# Altium project Template.PrjPCB
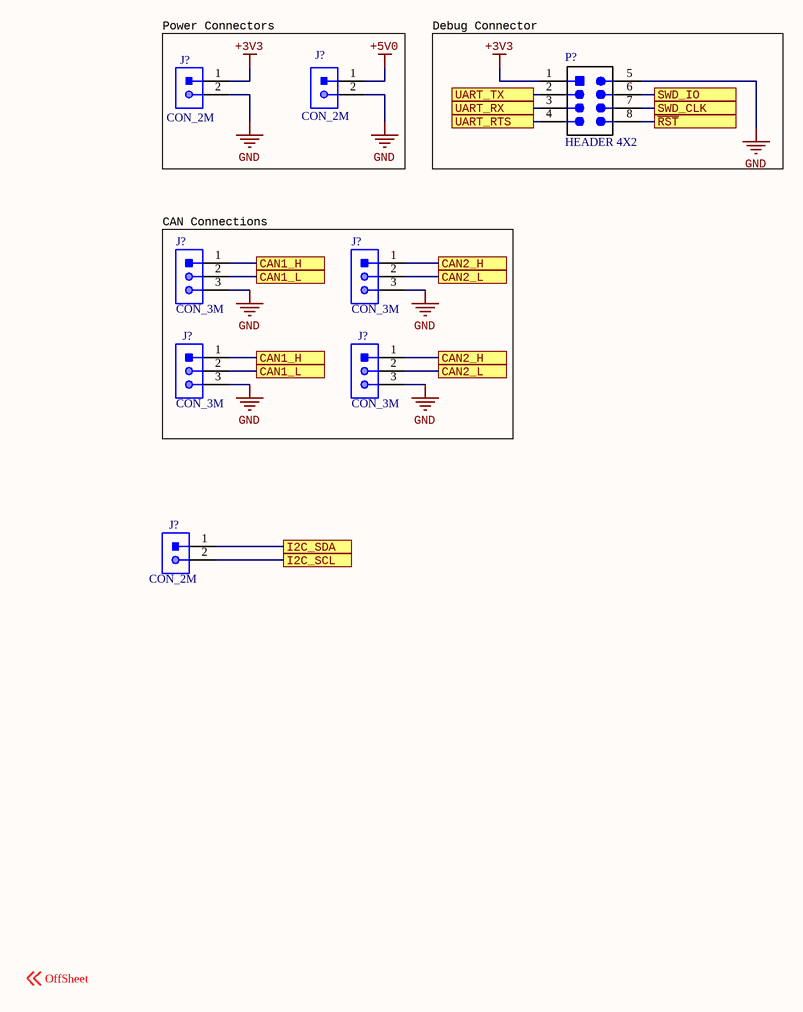
[diagram p0: Connectors.SchDoc]
DrawnBy: Your Name; BoardName: Your Board Name; Address4: Canada N2L 3G6; Address3: Ontario; Address2: Waterloo; Address1: 200 University Avenue
5 sheets, 45 parts. Net scope: flat (ports and power ports of the same name join across sheets).
Board file: Template.PcbDoc
Sheets:
  Connectors.SchDoc
  Support.SchDoc
  CAN.SchDoc
  MCU.SchDoc
  Power.SchDoc

## Sheet Connectors.SchDoc
size A4

### Parts
(Parts that share a designator on the sheet are numbered #1, #2 ... from top to bottom, then left to right.)
J?#1  CON_2M  [JST-B2B-PHSK]
J?#2  CON_2M  [JST-B2B-PHSK]
J?#3  CON_3M  [JST-B3B-SM4-TB]
J?#4  CON_3M  [JST-B3B-SM4-TB]
J?#5  CON_3M  [JST-B3B-SM4-TB]
J?#6  CON_3M  [JST-B3B-SM4-TB]
J?#7  CON_2M  [JST-B2B-PHSK]
P?  HEADER 4X2  [HEADER_2X4]

### Blocks framed on the sheet
Power Connectors: J?#1 J?#2
Debug Connector: P?
CAN Connections: J?#3-J?#6

### Ports
CAN1_H, CAN1_L, CAN2_H, CAN2_L, I2C_SCL, I2C_SDA, SWD_CLK, SWD_IO, UART_RTS, UART_RX, UART_TX, ~{RST}

### Nets
+3V3: J?#1.1 P?.1(VCC)
+5V0: J?#2.1
GND: J?#1.2 J?#2.2 J?#3.3 J?#4.3 J?#5.3 J?#6.3 P?.5(GND)  [project net  GND]
NetC4_2: P?.8 ; port ~{RST}
NetJ?#3_1: J?#3.1 J?#5.1 ; port CAN1_H
NetJ?#3_2: J?#3.2 J?#5.2 ; port CAN1_L
NetJ?#4_1: J?#4.1 J?#6.1 ; port CAN2_H
NetJ?#4_2: J?#4.2 J?#6.2 ; port CAN2_L
NetJ?#7_1: J?#7.1 ; port I2C_SDA
NetJ?#7_2: J?#7.2 ; port I2C_SCL
NetP?_2: P?.2 ; port UART_TX
NetP?_3: P?.3 ; port UART_RX
NetP?_4: P?.4 ; port UART_RTS
NetP?_6: P?.6 ; port SWD_IO
NetP?_7: P?.7 ; port SWD_CLK

### Notes on the sheet
- Labels drawn without touching a wire or pin: OffSheet

### Library data of the parts
P? = HEADER 4X2: Header, 4-Pin Dual row; MPN: GRPB042VWVN-RC; Manufacturer: Sullins Connector Solutions; Digikey Part Number: S9015E-04-ND

## Sheet Support.SchDoc
size A4
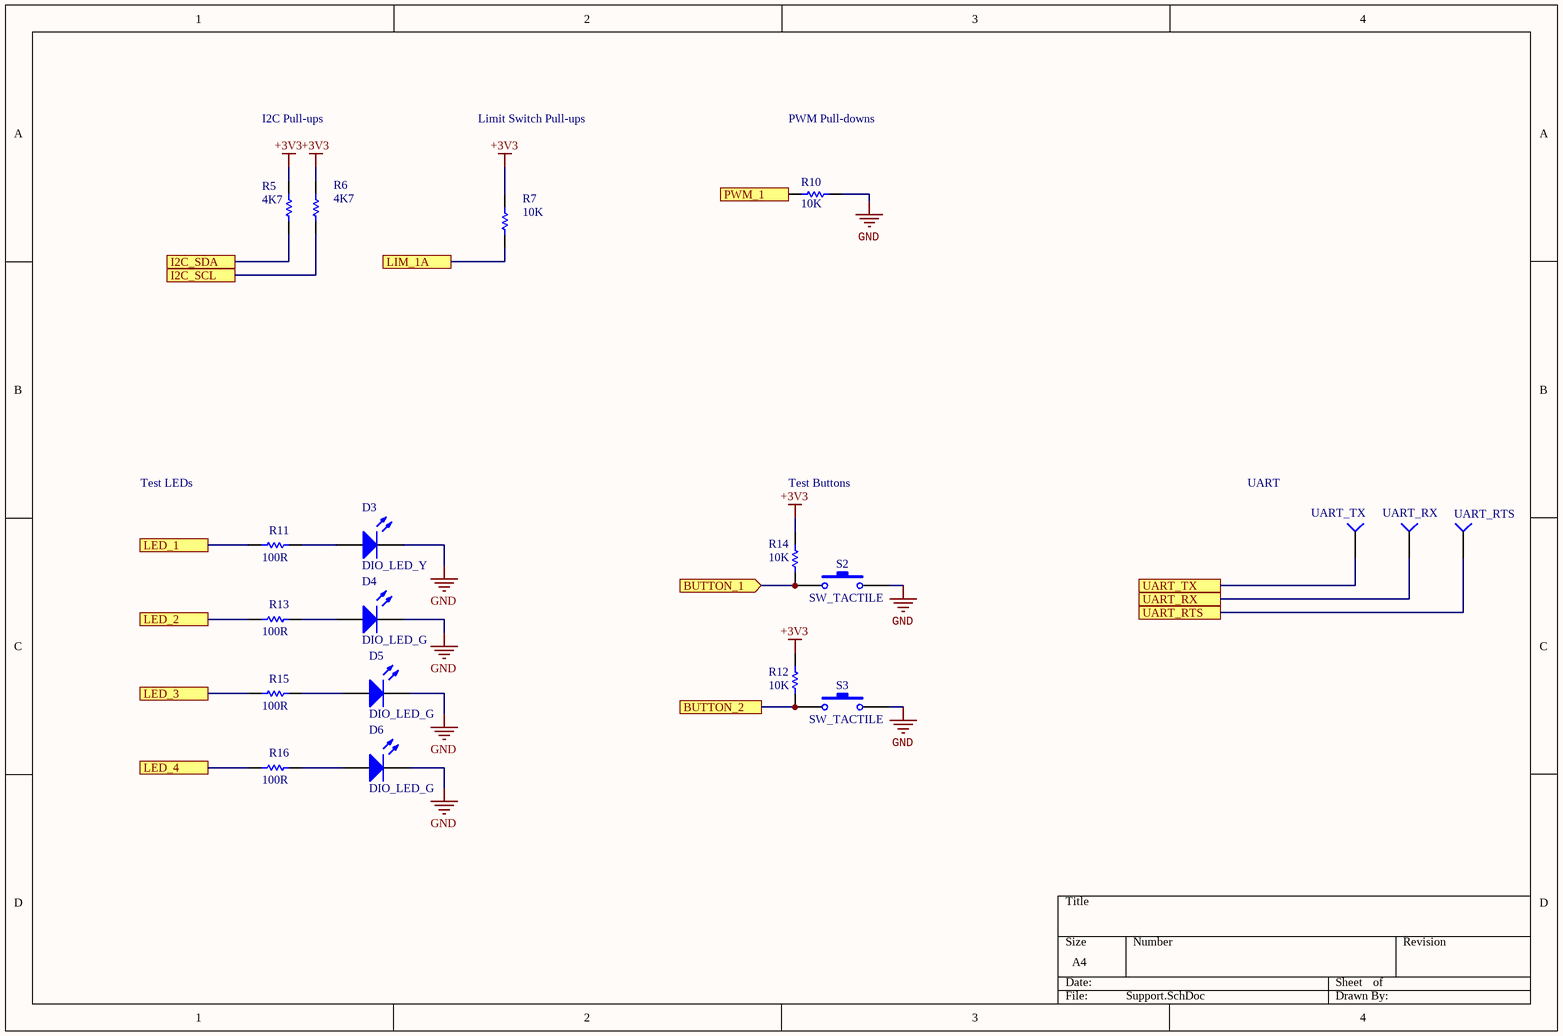
[diagram p1: Support.SchDoc]

### Parts
D3  DIO_LED_Y  [LED_0805_LINE]
D4  DIO_LED_G  [LED_0805_LINE]
D5  DIO_LED_G  [LED_0805_LINE]
D6  DIO_LED_G  [LED_0805_LINE]
R5  value 4K7  [RESC0603(1608)_N]  (hidden comment: RES_4K7_0603)
R6  value 4K7  [RESC0603(1608)_N]  (hidden comment: RES_4K7_0603)
R7  value 10K  [RESC0603(1608)_N]  (hidden comment: RES_10K_0603)
R10  value 10K  [RESC0603(1608)_N]  (hidden comment: RES_10K_0603)
R11  value 100R  [RESC0603(1608)_N]  (hidden comment: RES_100R_0603)
R12  value 10K  [RESC0603(1608)_N]  (hidden comment: RES_10K_0603)
R13  value 100R  [RESC0603(1608)_N]  (hidden comment: RES_100R_0603)
R14  value 10K  [RESC0603(1608)_N]  (hidden comment: RES_10K_0603)
R15  value 100R  [RESC0603(1608)_N]  (hidden comment: RES_100R_0603)
R16  value 100R  [RESC0603(1608)_N]  (hidden comment: RES_100R_0603)
S2  SW_TACTILE  [B3U-1100P]
S3  SW_TACTILE  [B3U-1100P]
UART_RTS  TESTPOINT  (value not drawn)
UART_RX  TESTPOINT  (value not drawn)
UART_TX  TESTPOINT  (value not drawn)

### Ports
BUTTON_1 (in), BUTTON_2, I2C_SCL, I2C_SDA, LED_1, LED_2, LED_3, LED_4, LIM_1A, PWM_1, UART_RTS, UART_RX, UART_TX

### Nets
+3V3: R5.2 R6.2 R7.2 R12.2 R14.1
GND: D3.2(K) D4.2(K) D5.2(K) D6.2(K) R10.1 S2.2 S3.2  [project net  GND]
NetD3_1: D3.1(A) R11.2
NetD4_1: D4.1(A) R13.2
NetD5_1: D5.1(A) R15.2
NetD6_1: D6.1(A) R16.2
NetJ?#7_1: R5.1 ; port I2C_SDA
NetJ?#7_2: R6.1 ; port I2C_SCL
NetP?_2: UART_TX.1(=value) ; port UART_TX
NetP?_3: UART_RX.1(=value) ; port UART_RX
NetP?_4: UART_RTS.1(=value) ; port UART_RTS
NetR7_1: R7.1 ; port LIM_1A
NetR10_2: R10.2 ; port PWM_1
NetR11_1: R11.1 ; port LED_1
NetR12_1: R12.1 S3.1 ; port BUTTON_2
NetR13_1: R13.1 ; port LED_2
NetR14_2: R14.2 S2.1 ; port BUTTON_1
NetR15_1: R15.1 ; port LED_3
NetR16_1: R16.1 ; port LED_4

### Notes on the sheet
- I2C Pull-ups
- Limit Switch Pull-ups
- PWM Pull-downs
- Test LEDs
- Test Buttons
- UART

### Library data of the parts
D3 = DIO_LED_Y: LED YELLOW DIFFUSED 0805 SMD; Manufacturer: OSRAM; MPN: LY R976-PS-36; Forward Voltage Drop: 2.2V; Package: 0805 (2012 Metric); Digikey Part Number: 475-2560-1-ND
D4-D6 = DIO_LED_G: LED GREEN DIFFUSED 0805 SMD; Manufacturer: OSRAM; MPN: LG R971-KN-1; Forward Voltage Drop: 2.2V; Package: 0805 (2012 Metric); Digikey Part Number: 475-1410-1-ND
R5 R6 = RES_4K7_0603: RES SMD 4.7K OHM 5% 1/10W 0603; Manufacturer: Yageo; MPN: RC0603JR-074K7L; Package: 0603 (1608 Metric); Dimensions: 0.063" L x 0.031" W (1.60mm x 0.80mm); Tolerance: 5%; Digikey Part Number: 311-4.7KGRCT-ND
R7 R10 R12 R14 = RES_10K_0603: RES SMD 10K OHM 5% 1/10W 0603; Manufacturer: Yageo; MPN: RC0603JR-0710KL; Package: 0603 (1608 Metric); Dimensions: 0.063" L x 0.031" W (1.60mm x 0.80mm); Tolerance: 5%; Digikey Part Number: 311-10KGRCT-ND
R11 R13 R15 R16 = RES_100R_0603: RES SMD 100 OHM 1% 1/10W 0603; Manufacturer: Yageo; MPN: RC0603FR-07100RL; Package: 0603 (1608 Metric); Dimensions: 0.063" L x 0.031" W (1.60mm x 0.80mm); Tolerance: 1%; Digikey Part Number: 311-100HRCT-ND
S2 S3 = SW_TACTILE: Tactile Switch (Grey); Manufacturer: Omron Electronics Inc-EMC Div; Digikey Part Number: SW1021TR-ND; MPN: B3U-1100P

## Sheet CAN.SchDoc
size A4
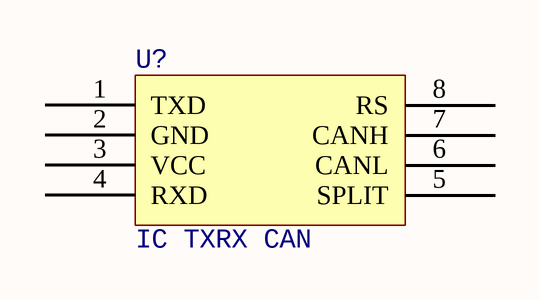
[diagram p2: CAN.SchDoc]

### Parts
U?  IC TXRX CAN  [LT-S8_N]

### Nets

Not connected (* = marked no-connect by the designer): U? 1(TXD) 2(GND) 3(VCC) 4(RXD) 5(SPLIT) 6(CANL) 7(CANH) 8(RS)

### Library data of the parts
U? = LTC2875: IC TXRX CAN 4MBPS 8SO; Manufacturer: Linear Technologies; MPN: LTC2875IS8#PBF; Package: 8-SOIC (0.154", 3.90mm Width); ComponentLink1Description: Datasheet; ComponentLink1URL: https://www.analog.com/media/en/technical-documentation/data-sheets/2875f.pdf; Digikey Part Number: LTC2875IS8#PBF-ND

## Sheet MCU.SchDoc
size Letter; Organization: UW Robotics; Address1: 200 University Avenue; Address2: Waterloo; Address3: Ontario; Address4: Canada N2L 3G6
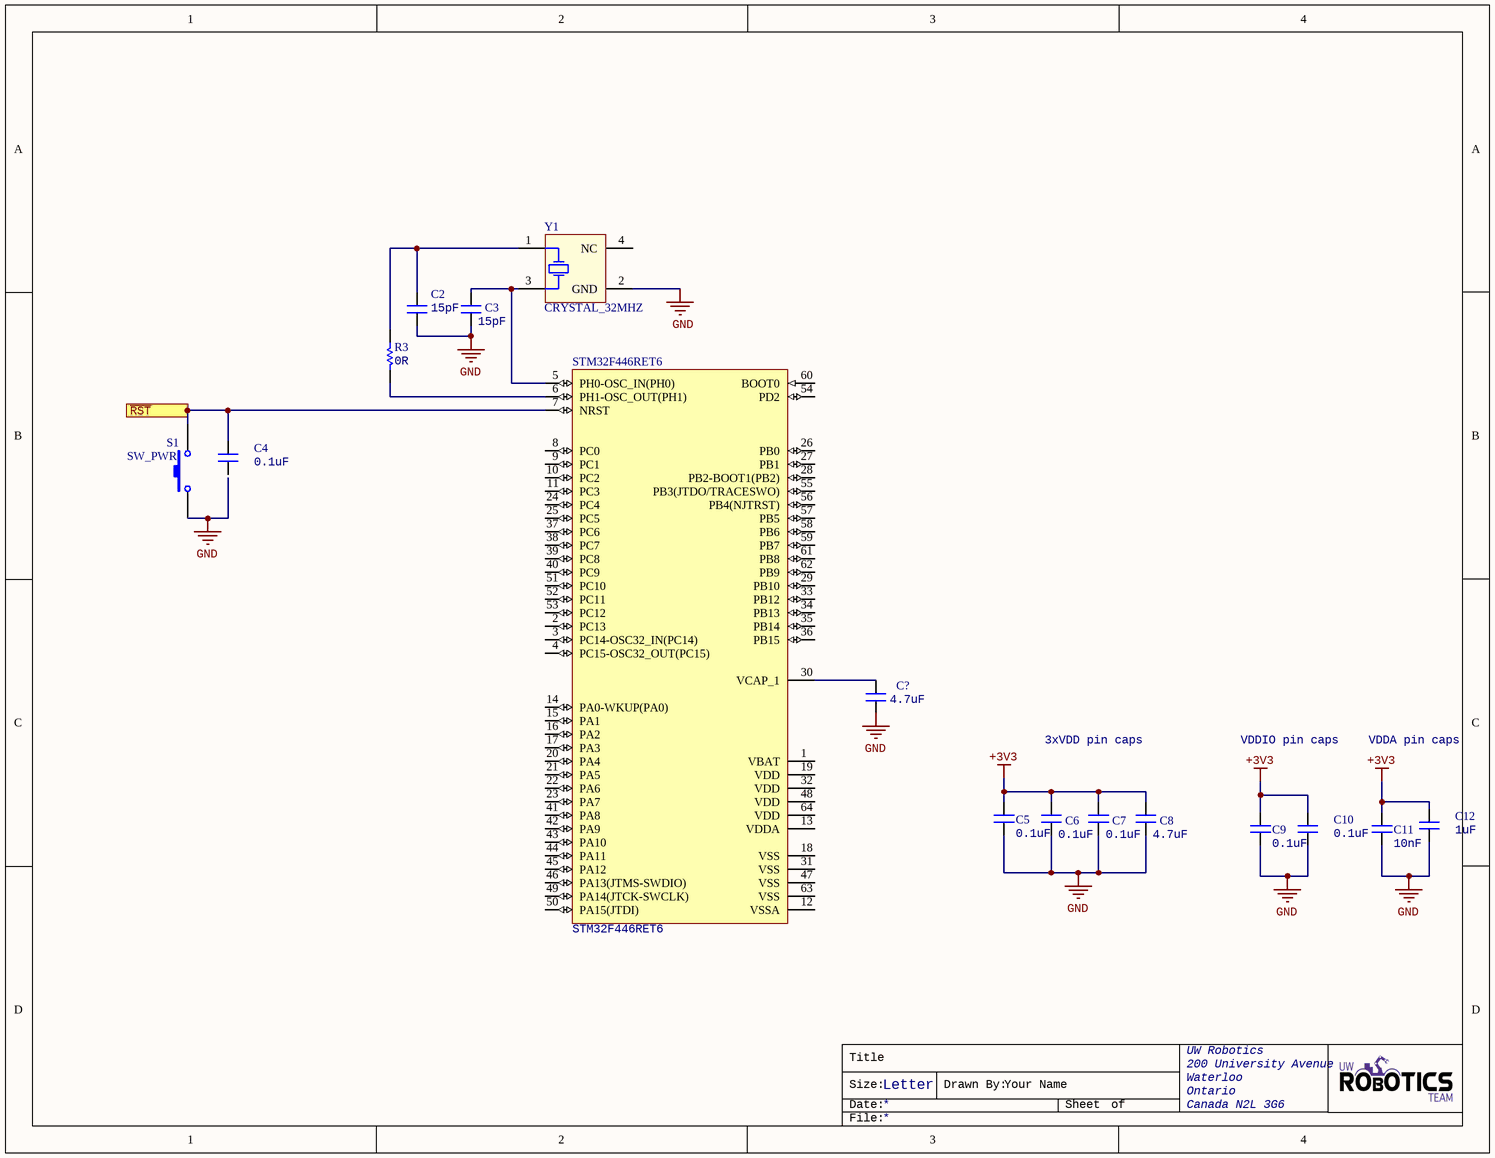
[diagram p3: MCU.SchDoc]

### Parts
C2  value 15pF  [CAPC0603(1608)55_N]  (hidden comment: CAP_15pF_0603)
C3  value 15pF  [CAPC0603(1608)55_N]  (hidden comment: CAP_15pF_0603)
C4  value 0.1uF  [CAPC0603(1608)55_N]  (hidden comment: CAP_0.1uF_16V_0603)
C5  value 0.1uF  [CAPC0603(1608)55_N]  (hidden comment: CAP_0.1uF_16V_0603)
C6  value 0.1uF  [CAPC0603(1608)55_N]  (hidden comment: CAP_0.1uF_16V_0603)
C7  value 0.1uF  [CAPC0603(1608)55_N]  (hidden comment: CAP_0.1uF_16V_0603)
C8  value 4.7uF  [CAPC0603(1608)55_N]  (hidden comment: CAP_4.7uF_0603)
C9  value 0.1uF  [CAPC0603(1608)55_N]  (hidden comment: CAP_0.1uF_16V_0603)
C10  value 0.1uF  [CAPC0603(1608)55_N]  (hidden comment: CAP_0.1uF_16V_0603)
C11  value 10nF  [CAPC0603(1608)55_N]  (hidden comment: CAP_10nF_0603)
C12  value 1uF  [CAPC0603(1608)55_N]  (hidden comment: CAP_1uF_16V_0603)
C?  value 4.7uF  [CAPC0603(1608)55_N]  (hidden comment: CAP_4.7uF_0603)
R3  value 0R  [RESC0603(1608)_N]  (hidden comment: RES_0R_0603)
S1  SW_PWR  [PTS830GM140]
STM32F446RET6  STM32F446RET6  [STM-LQFP64_L]
Y1  CRYSTAL_32MHZ  [AVX-CX2520DB32000D0GEJZ1-4_V]

### Ports
~{RST} (in)

### Nets
 GND: C2.1 C3.1 C5.1 C6.1 C7.1 C8.1 C9.1 C10.1 C11.1 C12.1 S1.1 Y1.2(GND)  [also labelled GND]
+3V3: C5.2 C6.2 C7.2 C8.2 C9.2 C10.2 C11.2 C12.2
NetC2_2: C2.2 R3.2 Y1.1(HOT)
NetC3_2: C3.2 STM32F446RET6.5(PH0-OSC_IN(PH0)) Y1.3(HOT)
NetC4_2: C4.2 S1.2 STM32F446RET6.7(NRST) ; port ~{RST}
NetC?_2: C?.2 STM32F446RET6.30(VCAP_1)
NetR3_1: R3.1 STM32F446RET6.6(PH1-OSC_OUT(PH1))

Not connected (* = marked no-connect by the designer): C4 1; C? 1; STM32F446RET6 1(VBAT) 2(PC13) 3(PC14-OSC32_IN(PC14)) 4(PC15-OSC32_OUT(PC15)) 8(PC0) 9(PC1) 10(PC2) 11(PC3) 12(VSSA) 13(VDDA) 14(PA0-WKUP(PA0)) 15(PA1) 16(PA2) 17(PA3) 18(VSS) 19(VDD) 20(PA4) 21(PA5) 22(PA6) 23(PA7) 24(PC4) 25(PC5) 26(PB0) 27(PB1) 28(PB2-BOOT1(PB2)) 29(PB10) 31(VSS) 32(VDD) 33(PB12) 34(PB13) 35(PB14) 36(PB15) 37(PC6) 38(PC7) 39(PC8) 40(PC9) 41(PA8) 42(PA9) 43(PA10) 44(PA11) 45(PA12) 46(PA13(JTMS-SWDIO)) 47(VSS) 48(VDD) 49(PA14(JTCK-SWCLK)) 50(PA15(JTDI)) 51(PC10) 52(PC11) 53(PC12) 54(PD2) 55(PB3(JTDO/TRACESWO)) 56(PB4(NJTRST)) 57(PB5) 58(PB6) 59(PB7) 60(BOOT0) 61(PB8) 62(PB9) 63(VSS) 64(VDD); Y1 4(NC)

### Notes on the sheet
- 3xVDD pin caps
- VDDIO pin caps
- VDDA pin caps
- Labels drawn without touching a wire or pin: GND
- Title
- Size:
- Date:
- Letter
- Drawn By:
- Sheet
- of
- File:

### Library data of the parts
C2 C3 = CAP_15pF_0603: CAP CER 15PF 250V NPO 0603; Manufacturer: Yageo; MPN: AC0603JRNPOYBN150; Temperature Coefficient: NP0; Dimensions: 0.063" L x 0.031" W (1.60mm x 0.80mm); Package: 0603 (1608 Metric); Voltage Rating: 250v; Digikey Part Number: 311-3282-1-ND
C4-C7 C9 C10 = CAP_0.1uF_16V_0603: CAP CER 0.1UF 16V X7R 0603; Manufacturer: Yageo; MPN: CC0603KRX7R7BB104; Dimensions: 0.063" L x 0.031" W (1.60mm x 0.80mm); Package: 0603 (1608 Metric); Temperature Coefficient: X7R; Voltage Rating: 16V; Digikey Part Number: 311-1088-1-ND
C8 C? = CAP_4.7uF_0603: CAP CER 4.7UF 6.3V X5R 0603; Manufacturer: Yageo; MPN: CC0603KRX5R5BB475; Dimensions: 0.063" L x 0.031" W (1.60mm x 0.80mm); Package: 0603 (1608 Metric); Temperature Coefficient: X5R; Voltage Rating: 6.3V; Digikey Part Number: 311-1521-1-ND
C11 = CAP_10nF_0603: CAP CER 10000PF 16V X7R 0603; Manufacturer: Yageo; MPN: CC0603KRX7R7BB103; Dimensions: 0.063" L x 0.031" W (1.60mm x 0.80mm); Package: 0603 (1608 Metric); Temperature Coefficient: X7R; Voltage Rating: 16V; Digikey Part Number: 311-3369-1-ND
C12 = CAP_1uF_16V_0603: CAP CER 1UF 16V Y5V 0603; Manufacturer: Yageo; MPN: CC0603ZRY5V7BB105; Dimensions: 0.063" L x 0.031" W (1.60mm x 0.80mm); Package: 0603 (1608 Metric); Temperature Coefficient: Y5V; Voltage Rating: 16V; Digikey Part Number: 311-1372-1-ND
R3 = RES_0R_0603: RES SMD 0 OHM JUMPER 1/10W 0603; Manufacturer: Yageo; MPN: RC0603JR-070RL; Package: 0603 (1608 Metric); Dimensions: 0.063" L x 0.031" W (1.60mm x 0.80mm); Digikey Part Number: 311-0.0GRCT-ND
S1 = SW_PWR: Power Switch (Red); pin to pad: 2>4; MPN: PTS830GM140 SMTR LFS; Manufacturer: C&K; ComponentLink1Description: Datasheet; ComponentLink1URL: https://www.ckswitches.com/media/1478/pts830.pdf; Digikey Part Number: CKN10587CT-ND
STM32F446RET6 = MCU_STM32F446RET6: ARM Cortex-M4 32-bit MCU+FPU, 512 KB Flash, 128 KB Internal RAM, 50 I/Os, 64-Pin LQFP, -40 to 85 degC, Tray; I/Os (High Current): 50; Supply Voltage(Vcc) min (V): 1.7; Operating Frequency(F) (Processor speed) (MHz): 180; D/A Converter: 2; Internal RAM Size (kB): 128; FLASH Size (Prog) (kB): 512; Core: ARM Cortex-M4; ComponentLink1Description: Manufacturer URL; Package Reference: 64-Pin Low-profile Quad Flat Package, Body 10 x 10 mm, Pitch 0.5 mm; ComponentLink2URL: http://www.st.com/st-web-ui/static/active/en/resource/technical/document/datasheet/DM00141306.pdf; Packing: Tray; DatasheetVersion: Rev. 6; ComponentLink1URL: http://www.st.com/; ComponentLink2Description: Datasheet; Package Description: LQFP64; Mounting Technology: Surface Mount
Y1 = CRYSTAL_32MHZ: CRYSTAL 32MHZ 8PF SMD; Manufacturer: Kyocera International Inc. Electronic Components; MPN: CX2520DB32000D0GPSC1; Package: 4-SMD, No Lead; Dimensions: 0.098" L x 0.079" W (2.50mm x 2.00mm); Digikey Part Number: 1253-1730-1-ND

## Sheet Power.SchDoc
size Letter; Organization: UW Robotics; Address1: 200 University Avenue; Address2: Waterloo; Address3: Ontario; Address4: Canada N2L 3G6
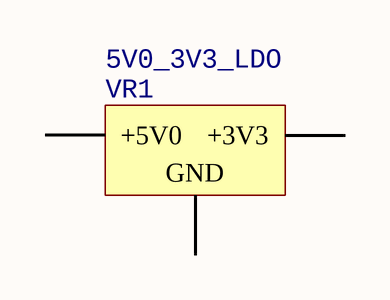
[diagram p4: Power.SchDoc]

### Parts
VR1  5V0_3V3_LDO  [VOLTAGE_REGULATOR]

### Nets

Not connected (* = marked no-connect by the designer): VR1 1(+5V0) 2(GND) 3(+3V3)

### Notes on the sheet
- Title
- Size:
- Date:
- Letter
- Drawn By:
- Sheet
- of
- File:

### Library data of the parts
VR1 = 5V0_3V3_LDO: IC REG LINEAR 3.3V 1A DPAK; Part Number: NCP1117DT33T5G; Manufacturer: ON Semiconductor; Current Output: 1A

## Nets that join several sheets
 GND: Connectors (7 pins), Support (7 pins), MCU (12 pins)
+3V3: Connectors (J?#1.1 P?.1), Support (5 pins), MCU (8 pins)
NetC4_2: Connectors (P?.8), MCU (C4.2 S1.2 STM32F446RET6.7)
NetJ?#7_1: Connectors (J?#7.1), Support (R5.1)
NetJ?#7_2: Connectors (J?#7.2), Support (R6.1)
NetP?_2: Connectors (P?.2), Support (UART_TX.1)
NetP?_3: Connectors (P?.3), Support (UART_RX.1)
NetP?_4: Connectors (P?.4), Support (UART_RTS.1)